# EasyEDA Pro project small_tv_screen.eprj

# Schematic Schematic1
Create Date: 2023-07-25; Page Name: P1; Project Name: small_tv_screen; Schematic Name: Schematic1; Update Date: 2023-07-26; Company: 嘉立创EDA; Page Size: A4; Version: V1.0
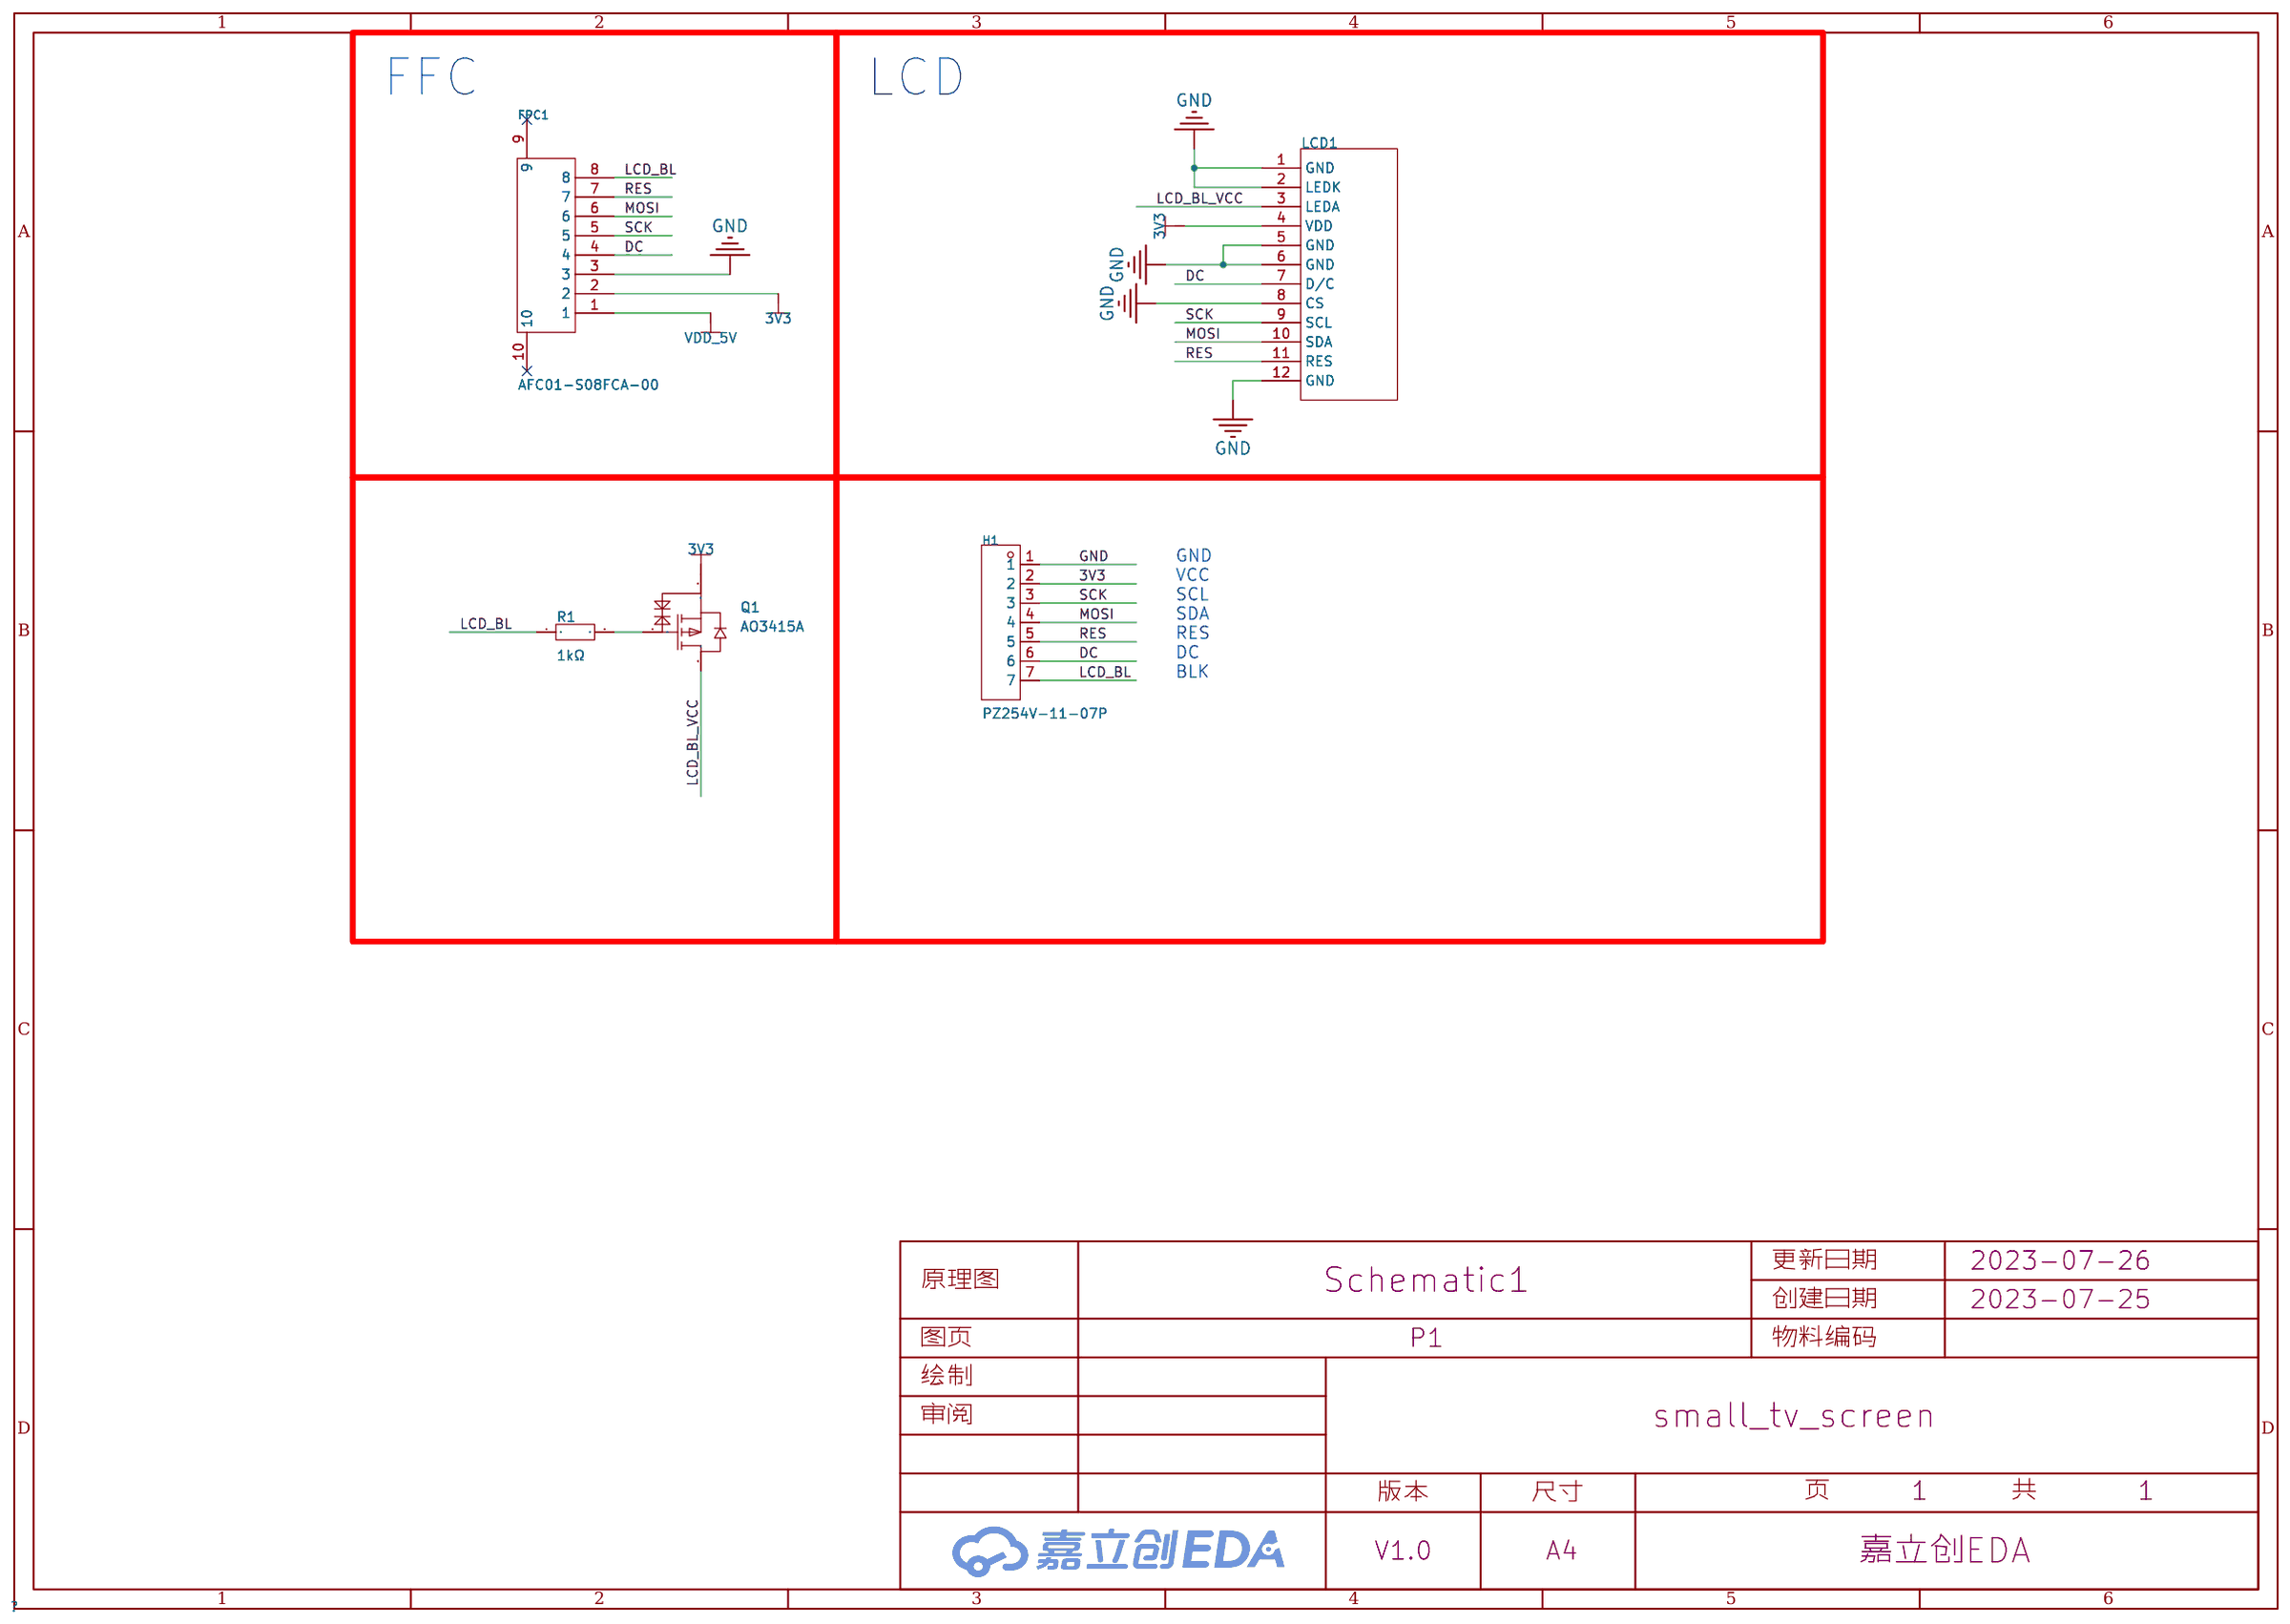
[diagram p0: schematic sheet]

## Parts
FPC1  AFC01-S08FCA-00  [FPC-SMD_P0.50-8P_FGS-XJ-H2.0]
H1  PZ254V-11-07P  [HDR-TH_7P-P2.54-V-M]
LCD1  LCD  [IPS_LED_240x240]
Q1  AO3415A  [SOT-23-3_L2.9-W1.6-P1.90-LS2.8-BR]
R1  1kΩ  [R0603]

## Library data of the parts
FPC1 = AFC01-S08FCA-00: 间距:0.5mm;触点数量:8P;锁定特性:翻盖式;安装类型:卧贴;触点类型:下接;; LCSC Part Name: 0.5mm P数:8P 翻盖式 下接; Supplier Part: C262657; Manufacturer: JS(钜硕电子); Supplier Footprint: SMD,P=0.5mm; JLCPCB Part Class: 扩展库; Datasheet: https://atta.szlcsc.com/upload/public/pdf/source/20190816/C413942_2A72D1AC756EAE17EEDF756A339D4500.pdf; Supplier: LCSC; Pitch: 0.5mm; Number of Contacts: 8P; Locking Feature: 翻盖式; Mounting Type: 卧贴; Contact Type: 下接; Height Above Board: 2mm; FFC, FCB Thickness: 0.3mm
H1 = PZ254V-11-07P: 排数:单排;总PIN位数:7P;间距:2.54mm;插针结构:1x7P;行距:-;安装类型:直插;圆针/方针:方针;额定电流:-;额定电压:-;配合针长度:6mm;塑高:2.5mm;端接针长度:3mm;触头材质:黄铜;触头镀层:-;工作温度范围:-40℃~+105℃;颜色:黑色;; LCSC Part Name: 2.54mm 1x7P 直插 方针; Supplier Part: C492406; Manufacturer: XFCN(兴飞); Supplier Footprint: 插件,P=2.54mm; JLCPCB Part Class: 扩展库; Datasheet: https://atta.szlcsc.com/upload/public/pdf/source/20200309/C492406_654C533EE691117E22DD9F76C114C2D9.pdf; Supplier: LCSC; Number of Rows: 单排; Number of Pins: 7P; Pitch: 2.54mm; Pin Structure: 1x7P; Mounting Type: 直插; Circluar Pins/Square Pins: 方针; Length of Mating Pin: 6mm; Insulation Height: 2.5mm; Length of End Connection Pin: 3mm; Contact Material: 黄铜; Operating Temperature Range: -40℃~+105℃; Color: 黑色
LCD1 = LCD-240X240
Q1 = AO3415A_C133233: 类型:P沟道;漏源电压(Vdss):20V;连续漏极电流(Id):5A;功率(Pd):1.5W;导通电阻(RDS(on)@Vgs,Id):45mΩ@4.5V,4A;; LCSC Part Name: P沟道 20V 5A; Supplier Part: C133233; Manufacturer: AOS; Supplier Footprint: SOT-23; JLCPCB Part Class: 扩展库; Datasheet: https://atta.szlcsc.com/upload/public/pdf/source/20171014/C133233_15079754867981038216.pdf; Supplier: LCSC; Type: P沟道; Drain Source Voltage (Vdss): 20V; Continuous Drain Current (Id): 5A; Power Dissipation (Pd): 1.5W; Drain Source On Resistance (RDS(on)@Vgs,Id): 45mΩ@4.5V,4A; Gate Threshold Voltage (Vgs(th)@Id): 850mV@250uA
R1 = 0603WAF1001T5E: 电阻类型:厚膜电阻;阻值:1kΩ;精度:±1%;功率:100mW;; LCSC Part Name: 1kΩ ±1% 100mW; Supplier Part: C21190; Manufacturer: UNI-ROYAL(厚声); Supplier Footprint: 0603; JLCPCB Part Class: 基础库; Datasheet: https://atta.szlcsc.com/upload/public/pdf/source/20200306/C422600_1E6D84923E4A46A82E41ADD87F860B5C.pdf; Supplier: LCSC; Type: 厚膜电阻; Tolerance: ±1%; Power(Watts): 100mW; Temperature Coefficient: ±100ppm/℃; Overload Voltage (Max): 75V; Operating Temperature Range: -55℃~+155℃

## Nets
3V3: FPC1.2 H1.2 LCD1.4(VDD) Q1.2(S)
GND: FPC1.3 H1.1 LCD1.1(GND) LCD1.2(LEDK) LCD1.5(GND) LCD1.6(GND) LCD1.8(CS) LCD1.12(GND)
VDD_5V: FPC1.1
DC: FPC1.4 H1.6 LCD1.7(D/C)
LCD_BL: FPC1.8 H1.7 R1.1
LCD_BL_VCC: LCD1.3(LEDA) Q1.3(D)
MOSI: FPC1.6 H1.4 LCD1.10(SDA)
RES: FPC1.7 H1.5 LCD1.11(RES)
SCK: FPC1.5 H1.3 LCD1.9(SCL)
$1N1055: Q1.1(G) R1.2

Not connected (* = marked no-connect by the designer): FPC1 9* 10*

## Notes on the sheet
- FFC
- LCD
- GND
- VCC
- SCL
- SDA
- DC
- RES
- BLK

# Board PCB1
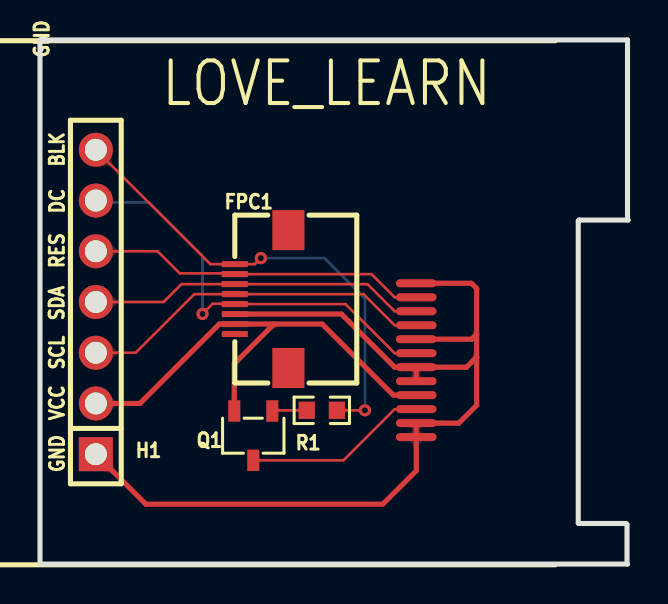
[diagram p1: board, top side]
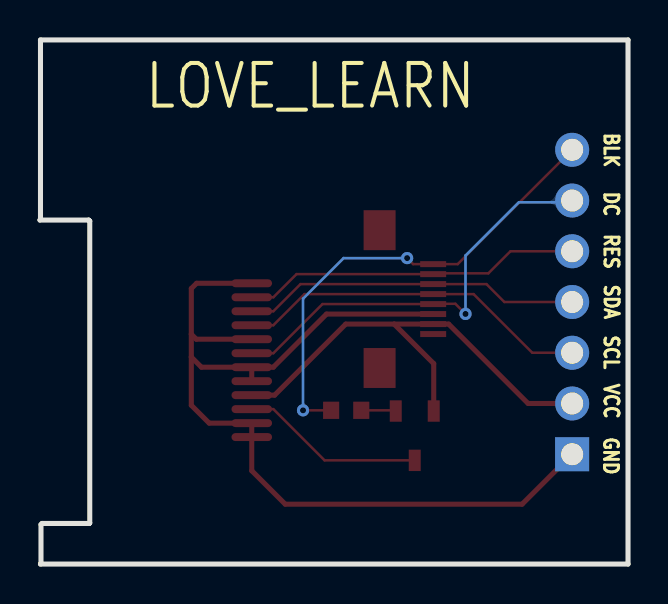
[diagram p2: board, bottom side, seen from below]

Outline 29.41 x 26.24 mm; copper layers: Top Layer, Bottom Layer. Coordinates in mm from the lower left corner of the outline.
Outline path: 0,26.24 29.39,26.24 29.39,17.25 29.41,17.22 26.97,17.22 26.92,17.17 26.92,2.06 26.95,2.03 29.31,2.03 29.36,1.98 29.36,0.03 29.39,0 0,0 0,26.24
Stack: Top Layer 0.035mm / Dielectric1 1.51mm FR4 er 4.5 / Bottom Layer 0.035mm

## Design rules (mm)
template: JLCPCB Capability(Two Layers Board)
spacing copperThickness1oz (default): track to track 0.102, other pairs 0.152 to 0.3
spacing copperThickness2oz: track to track 0.203, other pairs 0.152 to 0.3
track width copperThickness1oz (default): min 0.127, default 0.254, max 2.54
track width copperThickness2oz: min 0.203, default 0.254, max 2.54
differential pair differentialPair (default): width min 0.127, default 0.254, max 2.54; gap min 0.152, default 0.152
via viaSize (default): diameter min 0.5, default 0.61, max 10; hole min 0.3, default 0.305, max 6.3

## Placement (name value [footprint] x y rotation side)
FPC1  AFC01-S08FCA-00  [fpc-smd_p0.50-8p_fgs-xj-h2.0]  11.09 13.27 270 top
H1  PZ254V-11-07P  [hdr-th_7p-p2.54-v-m]  2.79 13.12 270 top
LCD1  LCD  [IPS_LED_240x240]  12.19 13.16 270 bottom
Q1  AO3415A  [SOT-23-3_L2.9-W1.6-P1.90-LS2.8-BR]  10.67 6.43 90 top
R1  1kΩ  [R0603]  14.1 7.7 180 top

## Footprints (pads in the part's own frame, mm; a bottom-side part is the same pattern mirrored in y, then rotated)
fpc-smd_p0.50-8p_fgs-xj-h2.0
  rect 0.3x1.3 smd: 1(1.75,-1.34) 2(1.252,-1.339) 3(0.75,-1.34) 4(0.25,-1.34) 5(-0.25,-1.34) 6(-0.75,-1.34) 7(-1.25,-1.34) 8(-1.75,-1.34)
  rect 2x1.6 smd: 9(-3.45,1.34) 10(3.45,1.34)
hdr-th_7p-p2.54-v-m
  rect 1.7x1.7 hole 1.1: 1(7.62,0)
  round 1.7 hole 1.1: 2(5.08,0) 3(2.54,0) 4(0,0) 5(-2.54,0) 6(-5.08,0) 7(-7.62,0)
IPS_LED_240x240
  rrect 0.4x2.032 smd far side: 1(6.801,-6.628) 2(6.101,-6.628) 3(5.402,-6.628) 4(4.702,-6.628) 5(4.002,-6.628) 6(3.301,-6.628) 7(2.602,-6.628) 8(1.901,-6.628) 9(1.202,-6.628) 10(0.501,-6.628) 11(-0.199,-6.628) 12(-0.898,-6.628)
R0603
  rect 0.806x0.864 smd: 1(-0.753,0) 2(0.753,0)
SOT-23-3_L2.9-W1.6-P1.90-LS2.8-BR
  rect 1.07x0.6 smd: 1(1.235,-0.95) 2(1.235,0.95) 3(-1.235,0)

## Nets
As in the schematic.

Pads without a net: FPC1 9 10

## Via types
v1: diameter 0.61, hole 0.305, Top Layer to Bottom Layer, 3 vias

## Routing (per net, layer and track width the routed paths; a pad name or vN(x,y) marks a point on that pad's centre or on a via; arc(x,y) is an arc through that point)
3V3: length 24.3
  Top Layer w0.254: H1.2 5,8.04 8.97,12.01 FPC1.2 11.7,12.01 ; 11.7,12.01 14.12,12.01 17.68,8.46 LCD1.4 ; 11.7,12.01 9.72,10.03 Q1.2
GND: length 49.7
  Top Layer w0.254: LCD1.6 17.74,9.86 15.08,12.52 FPC1.3 ; LCD1.6 LCD1.5 ; LCD1.6 21.34,9.86 21.84,10.36 ; LCD1.12 21.58,14.06 21.84,13.79 21.84,11.51 ; 21.84,11.51 21.59,11.26 LCD1.8 ; 21.84,11.51 21.84,10.36 ; 21.84,10.36 21.84,7.95 20.95,7.06 LCD1.2 LCD1.1 18.82,4.67 17.15,3 5.3,3 H1.1
DC: length 21.4
  Top Layer w0.127: 8.08,12.52 v1(8.13,12.52) 8.64,13.03 9.73,13.03 FPC1.4 15.28,13.02 17.74,10.56 LCD1.7
  Bottom Layer w0.127: v1(8.13,12.52) 8.13,15.44 5.46,18.11 2.88,18.11 H1.6
LCD_BL: length 23.8
  Top Layer w0.127: R1.1 v1(16.26,7.7) ; v1(11.05,15.32) 10.75,15.02 FPC1.8 8.52,15.02 H1.7
  Bottom Layer w0.127: v1(16.26,7.7) 16.26,13.28 14.22,15.32 v1(11.05,15.32)
LCD_BL_VCC: length 9.2
  Top Layer w0.127: 10.67,5.19 15.18,5.19 17.74,7.76 LCD1.3
MOSI: length 17
  Top Layer w0.127: H1.4 6.19,13.12 7.08,14.02 FPC1.6 16.38,14.02 17.74,12.66 LCD1.10
RES: length 17
  Top Layer w0.127: H1.5 5.88,15.66 6.99,14.55 9.71,14.55 FPC1.7 16.58,14.51 17.74,13.36 LCD1.11
SCK: length 17.9
  Top Layer w0.127: LCD1.9 17.74,11.96 16.18,13.51 FPC1.5 7.72,13.51 4.79,10.58 H1.3
$1N1055: length 1.7
  Top Layer w0.127: R1.2 11.65,7.7 Q1.1

## Copper pours and planes (outline as drawn; the poured copper is in the pictures)
GND on Top Layer: -8.76,28.65 38.86,28.65 38.86,-4.24 -8.76,-4.24
GND on Bottom Layer: -6.86,27.76 33.15,27.76 33.15,-2.08 -6.86,-2.08

Small or netless copper shapes (teardrops, artwork), in the pictures only: 41 on Top Layer, 4 on Bottom Layer

## Text on the board
Bottom Silkscreen Layer: SDA | BLK | RES | SCL | VCC | DC | GND | LOVE_LEARN
Top Silkscreen Layer: GND | SDA | BLK | RES | SCL | VCC | DC | LOVE_LEARN

# Board ExtendBoard
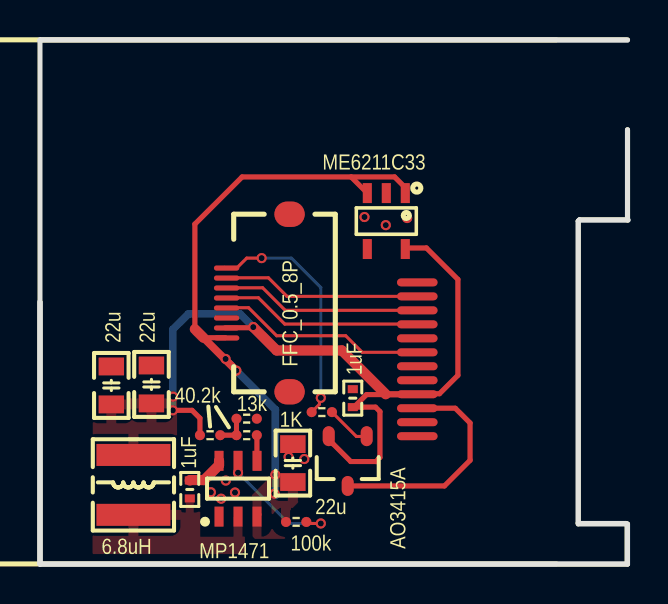
[diagram p3: board, top side]
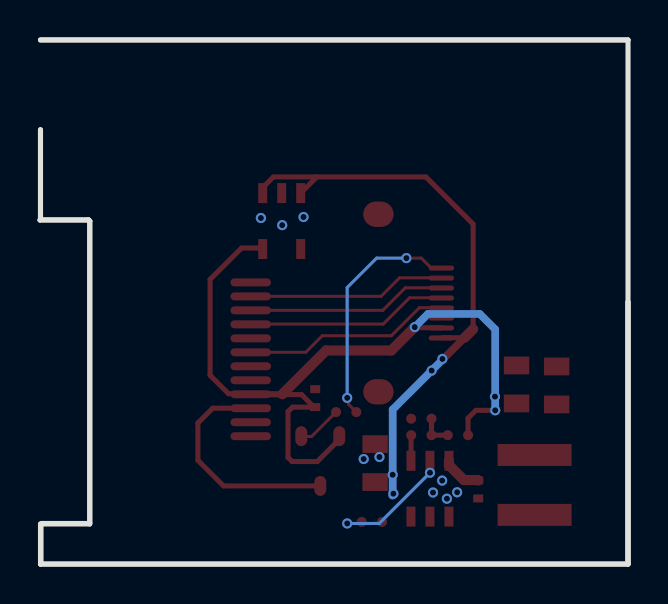
[diagram p4: board, bottom side, seen from below]

Outline 29.41 x 26.24 mm; copper layers: Top Layer, Inner1, Inner2, Inner3, Inner4, Inner5, Inner6, Inner7, Inner8, Inner9, Inner10, Inner11, Inner12, Inner13, Inner14, Inner15, Inner16, Inner17, Inner18, Inner19, Inner20, Inner21, Inner22, Inner23, Inner24, Inner25, Inner26, Inner27, Inner28, Inner29, Inner30, Bottom Layer. Coordinates in mm from the lower left corner of the outline.
Outline path: 0,26.24 29.39,26.24 0,26.24 ; 0,26.24 0,0 ; 0,0 0,13.12 0,0 ; 0,0 29.39,0 ; 0,0 29.39,0 ; 29.39,0 29.36,0.03 29.36,1.98 29.31,2.03 26.95,2.03 26.92,2.06 26.92,17.17 ; 29.39,0 29.39,2.01 26.92,2.01 26.92,17.17 ; 26.92,17.17 26.99,17.23 29.39,17.23 ; 26.92,17.17 26.97,17.22 29.41,17.22 29.39,17.25 ; 29.39,17.25 29.39,21.74 29.39,17.25
Stack: Top Layer 0.0356mm / Dielectric 2 1mm PP-006 er 4.2 / Bottom Layer 0.0356mm

## Design rules (mm)
spacing Clearance (default): track to track 0.127, other pairs 0.127 to 0.127
track width Width (default): min 0.102, default 0.102, max 254
differential pair DiffPairsRouting (default): width min 0.102, default 0.102, max 0.102; gap min 0.229, default 0.229
via RoutingVias (default): diameter min 0.305, default 0.406, max 1.27; hole min 0.152, default 0.203, max 0.711

## Placement (name value [footprint] x y rotation side)
1  LCD-240x240  [LCD-240x240-NoHole]  13.61 13.56 90 top
C1  1uF  [C 0402_L]  15.65 8.31 90 top
C2  1uF  [C 0402_L]  7.49 3.73 270 top
C3  22uF  [C 0805_L]  3.57 8.94 270 top
C4  22uF  [C 0805_L]  5.58 8.99 270 top
C5  22uF  [C 0805_L]  12.65 5.05 270 top
CON1  -  [FFC_0.5_8]  11.6 13.07 90 top
L1  6.8uH  [NR4030]  4.67 3.96 270 top
Q1  AO3415A  [SOT23-3]  15.39 5.16 270 top
R1  1K  [RES_0402]  14.1 7.61 0 top
R2  100K  [RES_0402]  12.81 2.11 180 top
R3  40.2K  [RES_0402]  8.51 6.45 180 top
R4  40.2K  [RES_0402]  10.34 6.45 0 top
R5  13K  [RES_0402]  10.34 7.28 0 top
U1  MP1471 降压芯片  [SOT23-6L]  9.91 3.77 0 top
V1  ME6211C33  [SOT23-5L]  17.32 17.17 180 top

## Footprints (pads in the part's own frame, mm; a bottom-side part is the same pattern mirrored in y, then rotated)
C 0402_L
  rect 0.4x0.5 smd: 1(-0.45,0) 2(0.45,0)
C 0805_L
  rect 0.889x1.27 smd: 1(-0.95,0) 2(0.95,0)
FFC_0.5_8
  rrect 1.27x1.524 smd: 0(-4.445,-0.889) 0(4.445,-0.889)
  rrect 0.254x1.27 smd: 1(-1.75,2.26) 2(-1.25,2.26) 3(-0.75,2.26) 4(-0.25,2.26) 5(0.25,2.26) 6(0.75,2.26) 7(1.25,2.26) 8(1.75,2.26)
LCD-240x240-NoHole
  rrect 0.4x2.032 smd: 1(-7.163,-5.258) 2(-6.463,-5.258) 3(-5.763,-5.258) 4(-5.063,-5.258) 5(-4.363,-5.258) 6(-3.663,-5.258) 7(-2.963,-5.258) 8(-2.263,-5.258) 9(-1.563,-5.258) 10(-0.863,-5.258) 11(-0.163,-5.258) 12(0.537,-5.258)
NR4030
  rect 1.1x3.7 smd: 1(-1.5,0) 2(1.5,0)
RES_0402
  rrect 0.508x0.508 smd: 1(-0.508,0) 2(0.508,0)
SOT23-3
  rrect 1x0.6 smd: 1(-1.246,0.95) 2(-1.246,-0.95) 3(1.246,0)
SOT23-5L
  rect 0.45x1 smd: 1(-0.95,-1.4) 2(0,-1.4) 3(0.95,-1.4) 4(0.95,1.4) 5(-0.95,1.4)
SOT23-6L
  rect 0.45x1 smd: 1(-0.95,-1.397) 2(0,-1.397) 3(0.95,-1.397) 4(0.95,1.397) 5(0,1.397) 6(-0.95,1.397)

## Nets
3V3: 1.4 C1.1 C3.2 C4.2 CON1.2 L1.1 Q1.2 R3.2 V1.5
GND: 1.1 1.2 1.5 1.6 1.8 1.12 C1.2 C3.1 C4.1 C5.1 CON1.0 CON1.3 R5.2 U1.1 V1.2
VDD_5V: C5.2 CON1.1 R2.2 U1.3 V1.1 V1.3
DC: 1.7 CON1.4
FB: R4.2 U1.4
LCD_BL: CON1.8 R1.1
LCD_BL_VCC: 1.3 Q1.3
MOSI: 1.10 CON1.6
NETC2_1: C2.1 U1.6
NETC2_2: C2.2 L1.2 U1.2
NETQ1_1: Q1.1 R1.2
NETR2_1: R2.1 U1.5
NETR3_1: R3.1 R4.1 R5.1
RES: 1.11 CON1.7
SCK: 1.9 CON1.5

Pads without a net: V1 4

## Via types
v1: diameter 0.508, hole 0.305, Top Layer to Bottom Layer, 20 vias

## Routing (per net, layer and track width the routed paths; a pad name or vN(x,y) marks a point on that pad's centre or on a via; arc(x,y) is an arc through that point)
3V3: length 42.5
  Top Layer w0.254: 18.28,8.48 16.33,8.48 15.7,7.86 ; 18.28,8.48 18.26,8.5 ; 18.28,8.48 18.8,8.48 18.85,8.53 19.98,8.53 20.9,9.45 20.9,14.25 19.33,15.82 18.33,15.82 V1.5 ; 15.7,7.86 16.78,7.86 17.01,7.63 17.01,5.33 16.8,5.13 15.54,5.13 14.65,6.03 14.63,6.03 14.44,6.21 Q1.2 ; 15.7,7.86 C1.1 ; R3.2 8,7.3 7.61,7.7 v1(6.64,7.7) ; 9.27,11.83 10.64,11.83 v1(10.67,11.86)
  Top Layer w0.305: 17.29,8.5 18.26,8.5
  Top Layer w0.508: 17.29,8.5 15.1,10.69 11.84,10.69 v1(10.67,11.86)
  Bottom Layer w0.381: v1(6.64,7.7) 6.64,11.75 7.42,12.52 10.01,12.52 v1(10.67,11.86)
  vias: v1(6.66,8.38)
GND:
  vias: v1(8.55,3.59) v1(9.06,3.27) v1(9.3,4.18) v1(9.75,3.58) v1(12.43,5.36) v1(13.22,5.26) v1(16.23,17.37) v1(17.3,16.97) v1(18.36,17.32)
VDD_5V: length 30.5
  Top Layer w0.254: 8.18,11.33 9.27,11.33 ; V1.1 18.27,18.85 17.74,19.38 15.56,19.38 ; 15.56,19.38 10.11,19.38 7.75,17.02 7.75,11.76 ; 15.56,19.38 V1.3 ; U1.3 10.86,2.38 10.95,2.48
  Top Layer w0.381: 12.46,4.1 C5.2 ; 8.18,11.33 v1(9.82,9.69)
  Top Layer w0.508: 7.75,11.76 8.18,11.33
  Bottom Layer w0.381: 11.79,3.43 11.77,3.44 v1(11.77,4.47) 11.77,7.73 v1(9.82,9.69) 9.32,10.19
  vias: v1(9.28,10.27) v1(11.73,3.52)
DC: length 10.5
  Top Layer w0.152: 18.82,10.6 16.12,10.6 15.29,11.43 11.84,11.43 10.44,12.83 9.27,12.83
FB: length 1.3
  Top Layer w0.254: R4.2 10.85,6.45 10.85,5.17 U1.4
LCD_BL: length 12
  Top Layer w0.102: 9.22,14.88 9.27,14.83
  Top Layer w0.152: R1.1 13.98,8 13.98,8.25 v1(14.05,8.32) ; v1(11.09,15.32) 10.34,15.32 9.84,14.82 CON1.8
  Bottom Layer w0.152: v1(14.05,8.32) 14.05,13.84 12.57,15.32 v1(11.09,15.32)
LCD_BL_VCC: length 11.5
  Top Layer w0.254: 1.3 20.77,7.8 21.51,7.06 21.51,5.19 20.23,3.91 Q1.3
MOSI: length 10.1
  Top Layer w0.152: 1.10 12.27,12.7 11.14,13.83 9.27,13.83
NETC2_1: length 2
  Top Layer w0.508: 8.96,5.17 8.96,4.95 8.21,4.2 7.51,4.2 C2.1
NETQ1_1: length 2.2
  Top Layer w0.152: R1.2 15.82,6.39 16.33,6.39 Q1.1
NETR2_1: length 6
  Top Layer w0.152: 13.28,2.03 v1(14.05,2.03)
  Bottom Layer w0.152: v1(9.91,4.57) 12.45,2.03 v1(14.05,2.03)
NETR3_1: length 1.6
  Top Layer w0.254: R5.1 R4.1 R3.1
RES: length 9.9
  Top Layer w0.152: 18.82,13.4 12.35,13.4 11.42,14.33 9.27,14.33
SCK: length 10.2
  Top Layer w0.102: 18.86,12.01 1.9
  Top Layer w0.152: 9.27,13.33 10.93,13.33 12.24,12.01 18.86,12.01

## Copper pours and planes (outline as drawn; the poured copper is in the pictures)
3V3 on Top Layer: 2.64,8.56 6.59,8.69 6.86,8.42 6.86,4.97 2.64,4.97 2.63,4.95
VDD_5V on Top Layer: 10.49,3.12 10.49,1.52 10.76,1.26 12.51,1.26 12.51,2.68 13.32,3.49 13.32,4.57 13.22,4.67 11.79,4.67 11.79,4.64 10.48,3.33
(no net) on Top Layer: 0.48,0.55 0.56,0.47 28.35,0.47
NETC2_2 on Top Layer: 9.59,2.98 10.25,2.98 10.25,0.7 10.26,0.69 9.94,0.37 2.63,0.37 2.63,2.97 2.86,3.2 6.71,3.2 7.08,3.58 8.06,3.57 8.01,3.52 8.01,1.37 9.6,1.37 9.63,1.35 9.63,2.85

## Text on the board
Top Silkscreen Layer: 6.8uH | 40.2k | MP1471 | 13k | 1K | 100k | 22u | ME6211C33 | 1uF | FFC_0.5_8P | AO3415A
